# EAGLE design untitled (EAGLE 8.3.2)
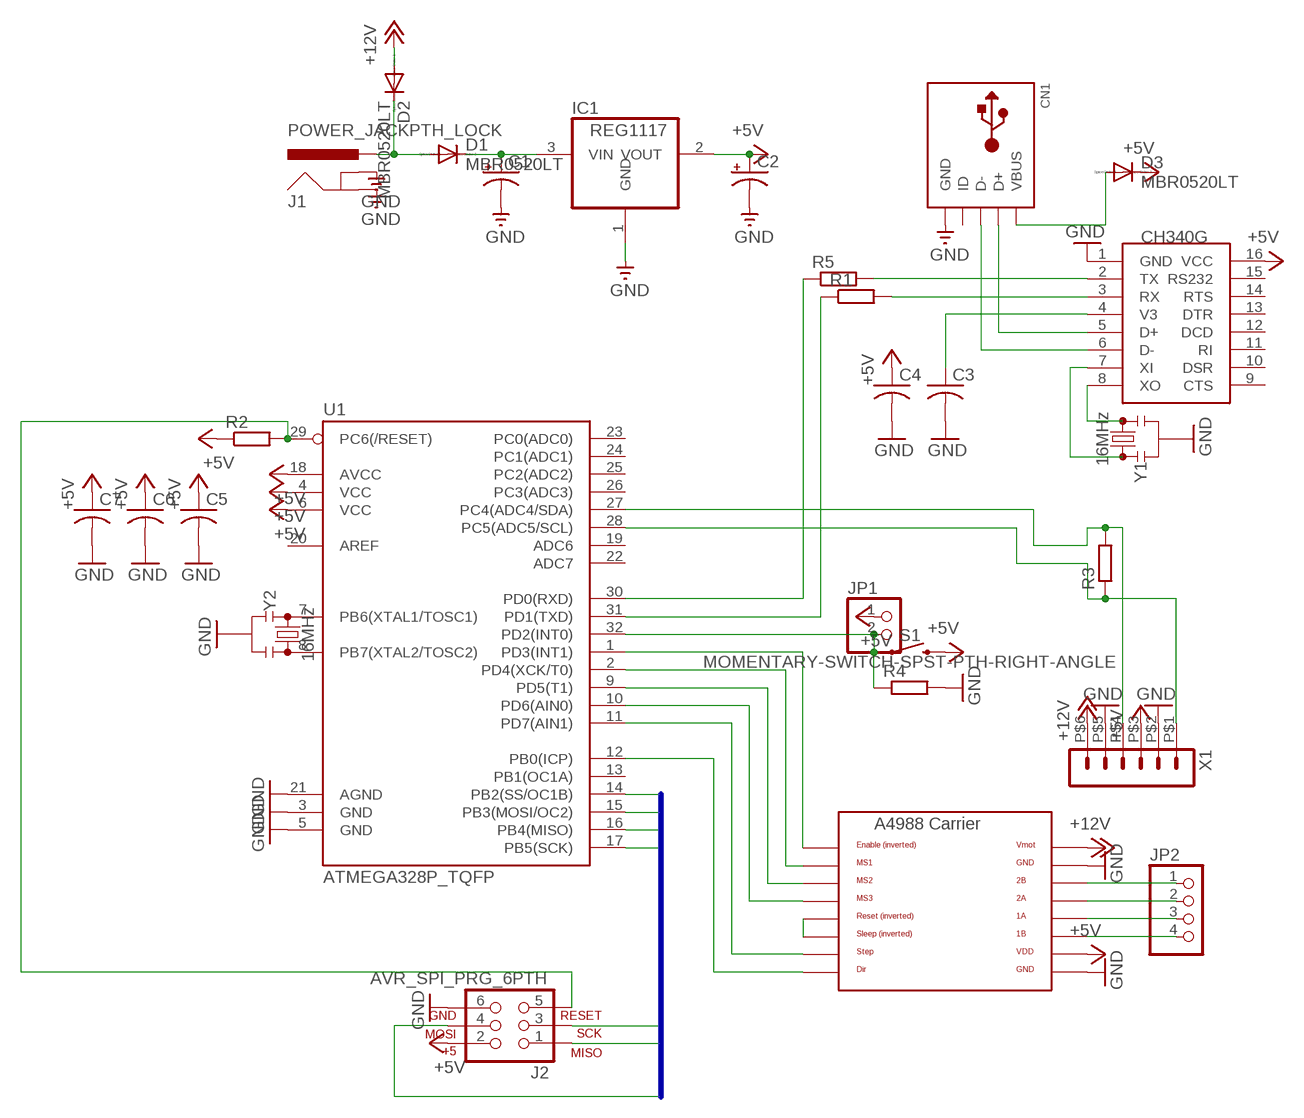
[diagram p0: schematic, sheet 1]

## Parts
C1  CPOL-US153CLV-0405  [153CLV-0405]
C2  CPOL-US153CLV-0405  [153CLV-0405]
C3  C-USC1210  [C1210]
C4  C-USC1210  [C1210]
C5  C-USC1210  [C1210]
C6  C-USC1210  [C1210]
C7  C-USC1210  [C1210]
CN1  USBMINIB  [USB-MINIB]
D1  MBR0520LT  [SOD123]
D2  MBR0520LT  [SOD123]
D3  MBR0520LT  [SOD123]
IC1  REG1117  [SOT223]
J1  POWER_JACKPTH_LOCK  [POWER_JACK_PTH_LOCK]
J2  AVR_SPI_PRG_6PTH  [2X3]
JP1  PINHD-1X2  [1X02]
JP2  PINHD-1X4  [1X04]
R1  R-EU_MELF0207W  [MINI_MELF-0207W]
R2  R-EU_MELF0207W  [MINI_MELF-0207W]
R3  R-EU_MELF0207W  [MINI_MELF-0207W]
R4  R-EU_MELF0207W  [MINI_MELF-0207W]
R5  R-EU_MELF0207W  [MINI_MELF-0207W]
S1  MOMENTARY-SWITCH-SPST-PTH-RIGHT-ANGLE  [TACTILE_SWITCH_PTH_RIGHT_ANGLE]
U1  ATMEGA328P_TQFP  [TQFP32-08]
U$1  CH340G  [SOIC16]
U$2  A4988BREAKOUT  [A4988BREAKOUT]
X1  HEADER_POS6_43045-0600  [43045-0600]
Y1  16MHz  RESONATOR-16MHZSMD_3.2X1.3  [RESONATOR-SMD-3.2X1.3]
Y2  16MHz  RESONATOR-16MHZSMD_3.2X1.3  [RESONATOR-SMD-3.2X1.3]

## Nets
+5V: C2.+ C4.1 C5.1 C6.1 C7.1 D3.C IC1.2(VOUT) J2.2 JP1.1 R2.1 S1.2 U1.4(VCC) U1.6(VCC) U1.18(AVCC) U$1.16(VCC) U$2.VDD X1.P$3
+12V: D2.A U$2.VMOT X1.P$6
CAN_CS: U1.14(PB2(SS/OC1B))
GND: C1.- C2.- C3.2 C4.2 C5.2 C6.2 C7.2 CN1.GND IC1.1(GND) J1.GND J1.GNDBREAK J2.6 R4.2 U1.3(GND) U1.5(GND) U1.21(AGND) U$1.1(GND) U$2.GND U$2.GND@0(GND) X1.P$2 X1.P$5 Y1.2 Y2.2
MISO: J2.1 U1.16(PB4(MISO))
MOSI: J2.4 U1.15(PB3(MOSI/OC2))
N$1: D1.A D2.C J1.PWR
N$2: R1.2 U$1.3(RX)
N$3: U1.1(PD3(INT1)) U$2.EN
N$4: U1.2(PD4(XCK/T0)) U$2.MS1
N$5: U1.8(PB7(XTAL2/TOSC2)) Y2.3
N$6: U1.7(PB6(XTAL1/TOSC1)) Y2.1
N$7: J2.5 R2.2 U1.29(PC6(/RESET))
N$8: R3.2 U1.27(PC4(ADC4/SDA)) X1.P$4
N$9: U1.9(PD5(T1)) U$2.MS2
N$10: U1.10(PD6(AIN0)) U$2.MS3
N$11: R3.1 U1.28(PC5(ADC5/SCL)) X1.P$1
N$12: C1.+ D1.C IC1.3(VIN)
N$99: JP1.2 R4.1 S1.1 U1.32(PD2(INT0))
N$100: U1.11(PD7(AIN1)) U$2.STEP
N$101: U1.12(PB0(ICP)) U$2.DIR
N$102: U$2.RST U$2.SLP(SLEEP)
N$103: JP2.1 U$2.2B
N$104: JP2.2 U$2.2A
N$105: JP2.3 U$2.1A
N$106: JP2.4 U$2.1B
N$107: U$1.8(XO) Y1.3
N$108: U$1.7(XI) Y1.1
N$109: R5.1 U1.30(PD0(RXD))
N$110: R1.1 U1.31(PD1(TXD))
N$111: R5.2 U$1.2(TX)
N$148: CN1.D+ U$1.5(D+)
N$149: CN1.D- U$1.6(D-)
N$150: CN1.VBUS D3.A
N$151: C3.1 U$1.4(V3)
SCK: J2.3 U1.17(PB5(SCK))
Unconnected: CN1.ID U1.13(PB1(OC1A)) U1.19(ADC6) U1.20(AREF) U1.22(ADC7) U1.23(PC0(ADC0)) U1.24(PC1(ADC1)) U1.25(PC2(ADC2)) U1.26(PC3(ADC3)) U$1.9(CTS) U$1.10(DSR) U$1.11(RI) U$1.12(DCD) U$1.13(DTR) U$1.14(RTS) U$1.15(RS232)

## Buses
SCK,MISO,MOSI,CAN_INT,CAN_CS

## Library data of the parts
C1 C2 = rcl:CPOL-US: POLARIZED CAPACITOR, American symbol
C3-C7 = rcl:C-US: CAPACITOR, American symbol
CN1 = adafruit:USB: USB Connectors USBMINIB - Surface Mount Female Mini-B USB Connector 4UConnector: 06564 By microbuilder.eu Thru-hole RA Female Mini-B USB Connector 4UConnector: 18732 By ladyada.net
D1-D3 = diode:MBR0520LT: SCHOTTKY BARRIER RECTIFIER Source: http://onsemi.com .. MBR0520LT1-D.pdf
IC1 = burr-brown:REG1117: 800mA and 1A Low Dropout (LDO) Positive Regulator 1.8V, 2.5V, 2.85V, 3.3V, 5V, and Adj
J1 = SparkFun:POWER_JACK: Power Jack This is the standard 5.5mm barrel jack for power. The PTH is the most common, proven, reliable, footprint. All others are experimental. The Slot footprint only works if the mill layer is transmitted to the PCB fab house so be warned. Spark Fun Electronics SKU : PRT-00119. Mating wall wart : TOL-00298 (and others)
J2 = SparkFun-Connectors:AVR_SPI_PRG_6: AVR ISP 6 Pin This is the reduced ISP connector for AVR programming. Common on Arduino. This footprint will take up less PCB space and can be used with a 10-pin to 6-pin adapter such as SKU: BOB-08508 **Special note about "TEST_POINT" package. The stop mask is on the top side, so if you want your programming test points to be on the bottom of your board, make sure to place this package on the bottom side of the board. This also ensure that the orientation to program from the bottom side will be correct.
JP1 = pinhead:PINHD-1X2: PIN HEADER
JP2 = pinhead:PINHD-1X4: PIN HEADER
R1-R5 = rcl:R-EU_: RESISTOR, European symbol
S1 = SparkFun-Switches:MOMENTARY-SWITCH-SPST: Momentary Switch (Pushbutton) - SPST Normally-open (NO) SPST momentary switches (buttons, pushbuttons). Variants PTH-12MM - 12mm square, through-hole Momentary Pushbutton Switch - 12mm Square <https://www.sparkfun.com/products/9190> (COM-09190) PTH-6.0MM, PTH-6.0MM-KIT - 6.0mm square, through-hole Mini Pushbutton Switch <https://www.sparkfun.com/products/97> (COM-00097) KIT package intended for soldering kit's - only one side of pads' copper is exposed. PTH-RIGHT-ANGLE-KIT - Right-angle, through-hole Right Angle Tactile Button <https://www.sparkfun.com/products/10791> - Used on SparkFun BigTime Watch Kit <https://www.sparkfun.com/products/11734> SMD-12MM - 12mm square, surface-mount Tactile Button - SMD (12mm) <https://www.sparkfun.com/products/12993> (COM-12993) Used on SparkFun PicoBoard <https://www.sparkfun.com/products/11888> SMD-4.5MM - 4.5mm Square Trackball Switch Used on SparkFun Blackberry Trackballer Breakout <https://www.sparkfun.com/products/13169> SMD-4.6MMX2.8MM - 4.60mm x 2.80mm, surface mount Used on SparkFun SAMD21 Mini Breakout <https://www.sparkfun.com/products/13664> SMD-5.2MM, SMD-5.2-REDUNDANT - 5.2mm square, surface-mount Mini Pushbutton Switch - SMD <https://www.sparkfun.com/products/8720> (COM-08720) Used on Arduino Pro Mini <https://www.sparkfun.com/products/11114> REDUNDANT package connects both switch circuits together SMD-6.0X3.5MM - 6.0 x 3.5mm, surface mount Momentary Reset Switch SMD <https://www.sparkfun.com/products/8229> (COM-08229) SMD-6.2MM-TALL - 6.2mm square, surface mount Tactile Button - SMD (6mm) <https://www.sparkfun.com/products/12992> Used on SparkFun Digital Sandbox <https://www.sparkfun.com/products/12651> SMD-RIGHT-ANGLE - Right-angle, surface mount Used on SparkFun Block for Intel® Edison - Arduino <https://www.sparkfun.com/products/13036>; PROD_ID: CONN-10672; SF_SKU: COM-10791
U1 = SparkFun-DigitalIC:ATMEGA328P_TQFP; PROD_ID: IC-09069
U$1 = ch340g:CH340G
U$2 = RepRapjr:A4988BREAKOUT
X1 = con-molex-micro-fit-3_0:HEADER_POS6_?: Molex - Micro-Fit 3.0 Series connector, 3.00mm (0.118") pitch header, 6 positions.
Y1 Y2 = SparkFun-Clocks:RESONATOR-16MHZ: 16MHz Resonator Digikey Example <http://www.digikey.com/product-detail/en/murata-electronics-north-america/CSTCE16M0V53-R0/490-1198-1-ND/584635> Frequency: 16MHz Frequency Stability: ±0.3% Frequency Tolerance: ±0.5% Capacitance: 15pF SparkFun Products SparkFun OpenLog <https://www.sparkfun.com/products/13712> SparkFun MicroView - OLED Arduino Module <https://www.sparkfun.com/products/12923>; PROD_ID: XTAL-08900

## Board
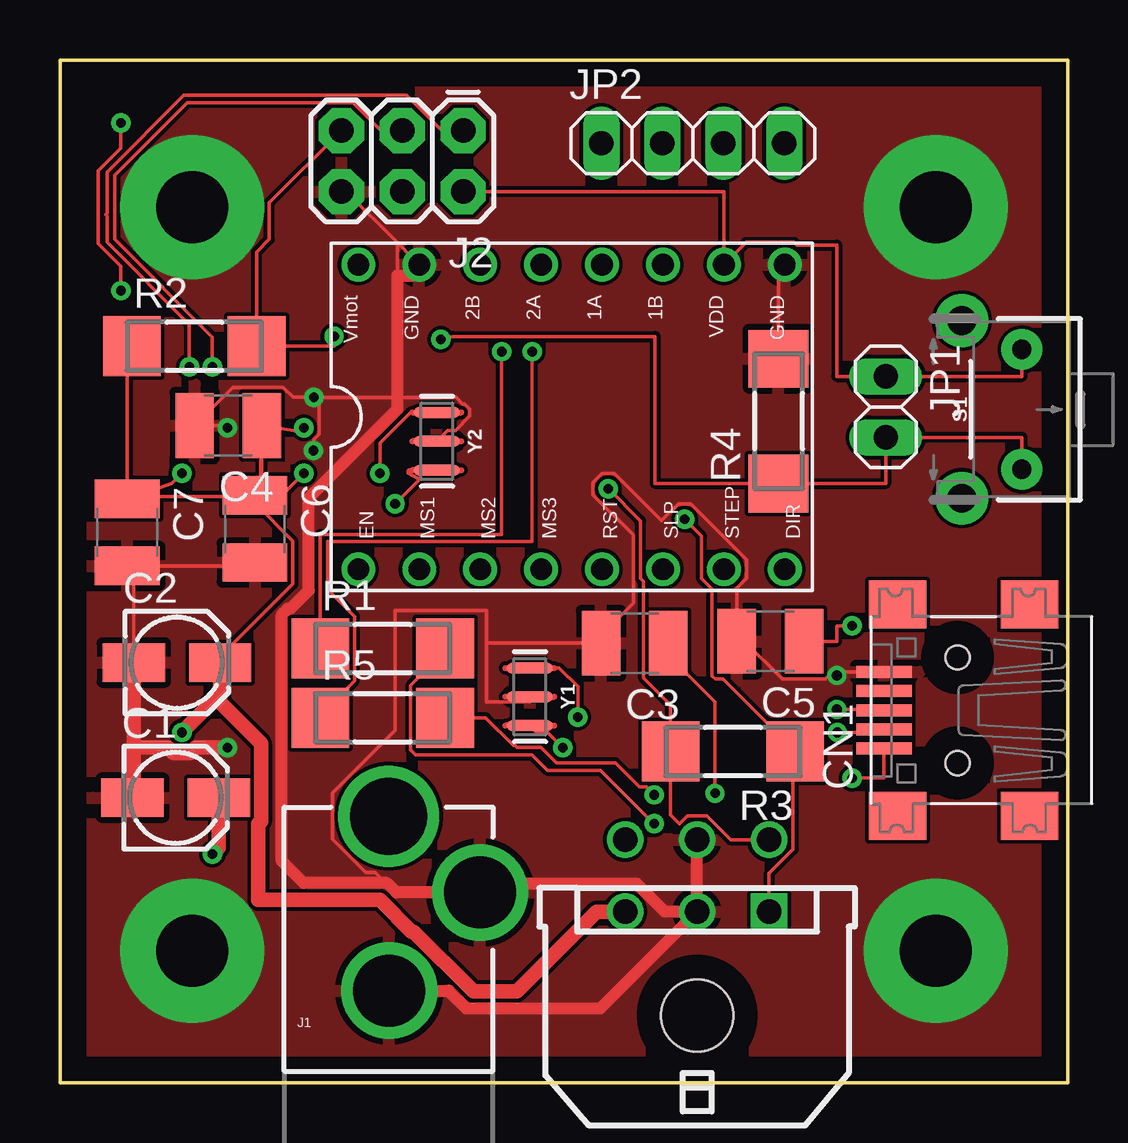
[diagram p1: board, top side]
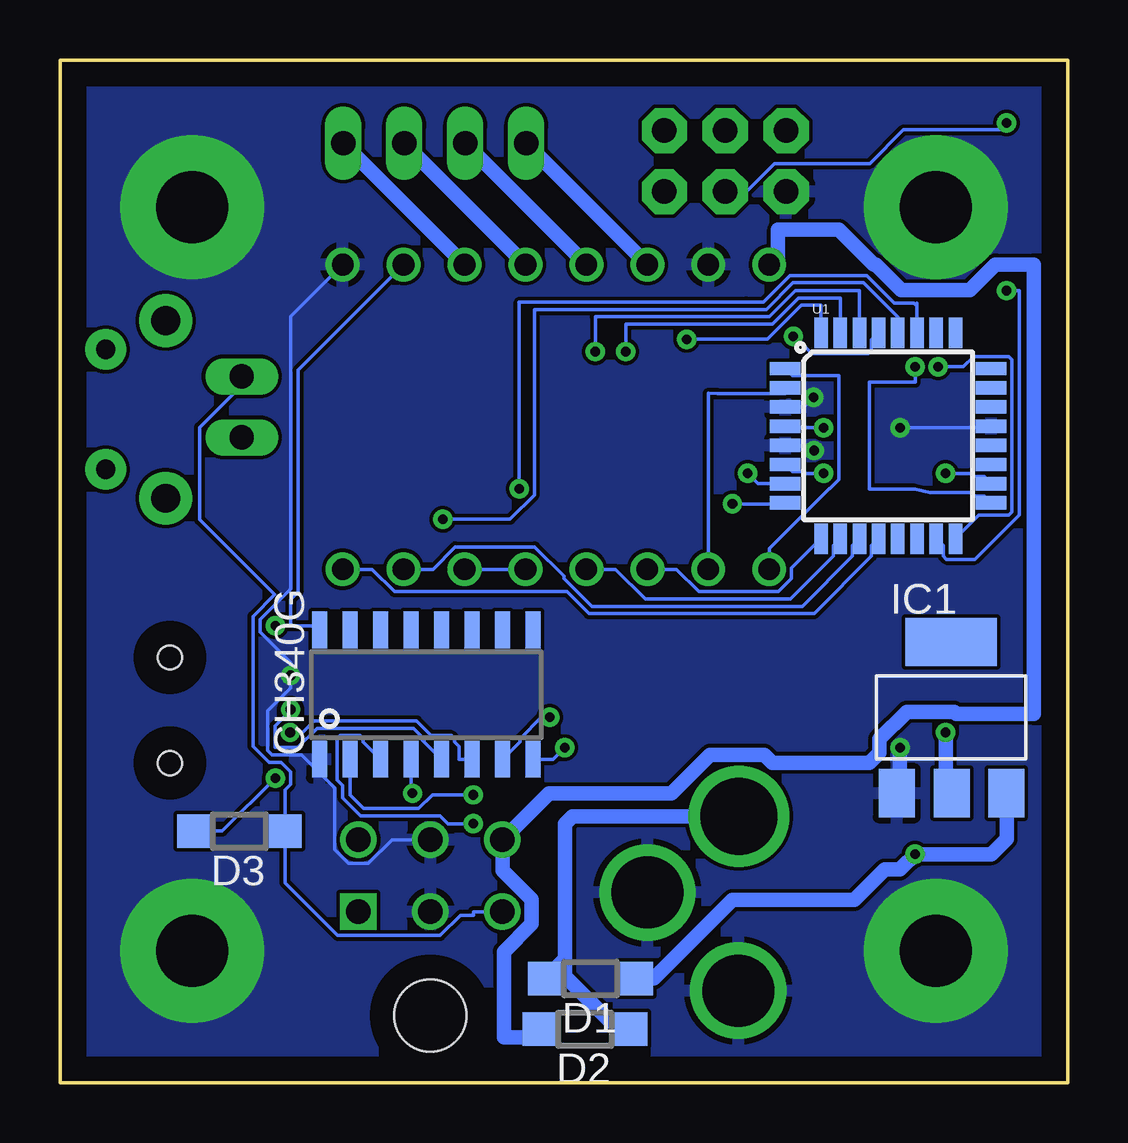
[diagram p2: board, bottom side, seen from below]

Size 42 x 42.63 mm. Coordinates in mm from the lower left corner, seen from the top.
Outline: 0,0 0,42.63 42,42.63 42,0 0,0
Copper layers (1*16): Top 0.035mm / dielectric 1.5mm / Bottom 0.035mm
Design rules "default": minimum track width 6mil, minimum drill 0.35mm, track to track 6mil, track to pad 6mil, pad to pad 6mil, via to via 6mil, smd to smd 6mil, copper to edge 40mil, drill to drill 6mil, minimum pad ring 10mil, minimum via ring 8mil, stop-mask expansion 4mil, vias tented up to drill 0mil, thermal gap 10mil

### Footprints (pad centres in the part's own frame; a part is rotated, then mirrored left to right if it is on the bottom)
153CLV-0405 = smd 2.6 x 1.6: + 1.8,0; - -1.8,0
C1210 = smd 1.6 x 2.7: 1 -1.4,0; 2 1.4,0
USB-MINIB = smd 0.5 x 2.308: D+ 0,4.064; D- -0.8,4.064; GND 1.6,4.064; ID 0.8,4.064; VBUS -1.6,4.064 | smd 2 x 2.4: GND1 -4.4,-2; GND2 -4.4,3.5; GND3 4.4,3.5; GND4 4.4,-2 | hole 1: -2.2,1; 2.2,1
SOD123 = smd 1.4 x 1.4: A 1.9,0; C -1.9,0
SOT223 = smd 1.499 x 2.007: 1 -2.261,-3.15; 2 0.025,-3.15; 3 2.311,-3.15 | smd 3.81 x 2.007: 4 0,3.15
POWER_JACK_PTH_LOCK = drill 2.997: GND 0.025,6.608; GNDBREAK 3.812,10.7 | drill 3.2: PWR 0,13.878
2X3 = drill 1.016 pad 1.88 octagon: 1 0,0; 2 0,2.54; 3 2.54,0; 4 2.54,2.54; 5 5.08,0; 6 5.08,2.54
1X02 = drill 1.016 long: 1 -1.27,0; 2 1.27,0
1X04 = drill 1.016 long: 1 -3.81,0; 2 -1.27,0; 3 1.27,0; 4 3.81,0
MINI_MELF-0207W = smd 2.4 x 2.5: 1 -2.6,0; 2 2.6,0
TACTILE_SWITCH_PTH_RIGHT_ANGLE = drill 0.8 pad 1.7: 1 -2.5,0; 2 2.5,0 | drill 1.2 pad 2.2: ANCHOR1 -3.703,2.5; ANCHOR2 3.703,2.5
TQFP32-08 = smd 1.27 x 0.559: 1 -4.293,2.8; 2 -4.293,2; 3 -4.293,1.2; 4 -4.293,0.4; 5 -4.293,-0.4; 6 -4.293,-1.2; 7 -4.293,-2; 8 -4.293,-2.8; 17 4.293,-2.8; 18 4.293,-2; 19 4.293,-1.2; 20 4.293,-0.4; 21 4.293,0.4; 22 4.293,1.2; 23 4.293,2; 24 4.293,2.8 | smd 0.559 x 1.27: 9 -2.8,-4.293; 10 -2,-4.293; 11 -1.2,-4.293; 12 -0.4,-4.293; 13 0.4,-4.293; 14 1.2,-4.293; 15 2,-4.293; 16 2.8,-4.293; 25 2.8,4.293; 26 2,4.293; 27 1.2,4.293; 28 0.4,4.293; 29 -0.4,4.293; 30 -1.2,4.293; 31 -2,4.293; 32 -2.8,4.293
SOIC16 = smd 0.635 x 1.524: 1 -4.445,-2.695; 2 -3.175,-2.695; 3 -1.905,-2.695; 4 -0.635,-2.695; 5 0.635,-2.695; 6 1.905,-2.695; 7 3.175,-2.695; 8 4.445,-2.695; 9 4.445,2.695; 10 3.175,2.695; 11 1.905,2.695; 12 0.635,2.695; 13 -0.635,2.695; 14 -1.905,2.695; 15 -3.175,2.695; 16 -4.445,2.695
A4988BREAKOUT = drill 0.9: 1A 8.89,1.27; 1B 11.43,1.27; 2A 6.35,1.27; 2B 3.81,1.27; DIR 16.51,-11.43; EN -1.27,-11.43; GND 16.51,1.27; GND@0 1.27,1.27; MS1 1.27,-11.43; MS2 3.81,-11.43; MS3 6.35,-11.43; RST 8.89,-11.43; SLP 11.43,-11.43; STEP 13.97,-11.43; VDD 13.97,1.27; VMOT -1.27,1.27
43045-0600 = drill 1.02 square: P$1 3,4.32 | drill 1.02: P$2 0,4.32; P$3 -3,4.32; P$4 3,7.32; P$5 0,7.32; P$6 -3,7.32 | hole 3: 0,0
RESONATOR-SMD-3.2X1.3 = smd 0.45 x 1.905: 1 -1.2,0; 2 0,0; 3 1.2,0

### Placement (x,y rotation side)
C1  4.82,11.88 0 top
C2  4.88,17.52 0 top
C3  23.95,18.32 180 top
C4  7.01,27.4 180 top
C5  29.61,18.41 180 top
C6  8.12,23.09 270 top
C7  2.8,22.95 270 top
CN1  38.41,15.53 90 top
D1  19.89,4.34 180 bottom
D2  20.12,2.23 180 bottom
D3  34.52,10.49 180 bottom
IC1  4.86,15.22 0 bottom
J1  13.7,-2.77 0 top
J2  16.81,39.69 180 top
JP1  34.42,28.18 270 top
JP2  26.38,39.16 0 top
R1  13.45,18.1 0 top
R2  5.6,30.7 0 top
R3  28.05,13.8 180 top
R4  29.95,27.58 90 top
R5  13.45,15.21 0 top
S1  40.09,28.07 90 top
U1  7.47,26.97 0 bottom
U$1  26.73,16.18 0 bottom
U$2  13.71,32.84 0 top
X1  26.56,2.81 0 top
Y1  19.59,16.09 270 top
Y2  15.71,26.74 270 top

### Tracks (layer width: path | path; a pad name or v marks a point on that pad's centre or on a via)
+5V  (via drill 0.4)
  Top 0.152: C5.1 32.38,18.41 32.38,19.05 v33.02,19.05 | C4.1 10,27.14 v10.16,27.3 | 8.26,24.48 C6.1 | 8.26,24.48 9.24,24.48 v10.16,25.4 | C4.1 8.35,24.58 8.26,24.48 | 3.09,24.43 C7.1 | 3.09,24.43 3.3,24.48 | C7.1 3.26,24.51 4.67,24.98 v5.08,25.4 | R2.1 2.8,30.51 C7.1 | S1.2 40.09,29.45 JP1.1 32.38,29.45 32.38,34.92 30.71,34.92 30.6,35.04 28.61,35.04 U$2.VDD 27.68,37.15 J2.2 | C7.1 2.8,24.43 3.09,24.43 | C6.1 8.12,24.43 | 8.12,24.43 3.09,24.43 | C4.1 8.41,24.43 8.12,24.43 | 6.67,17.14 6.67,17.76 9.7,20.79 9.7,22.58 8.12,24.16 C6.1
  Top 0.61: X1.P$3 22.37,7.13 19.05,3.81 17.24,3.81 14.75,6.3 14.65,6.3 13.34,7.62 8.27,7.62 8.27,10.79 8.38,10.9 8.38,14.14 6.67,15.85 6.67,16.2 | 6.67,16.2 6.67,17.14 C2.+ | 6.67,16.2 v5.08,14.61
  Bottom 0.152: X1.P$3 24.77,7.13 24.77,6.99 25.3,6.99 26.15,6.14 30.42,6.14 32.62,8.34 D3.C 32.62,12.2 32.39,12.44 32.39,12.96 32.79,13.36 33.29,13.36 33.96,14.03 33.96,19.44 33.05,20.35 36.18,23.48 36.18,27.32 34.42,29.07 JP1.1 | 32.38,19.05 31.35,19.05 U$1.16 | 32.38,19.05 v33.02,19.05 | 10.6,27.3 v10.16,27.3 11.7,27.3 U1.4 | v10.16,25.4 10.96,25.4 11.04,25.48 11.48,25.48 U1.6 | U1.18 3.47,25.26 3.91,25.26 4.05,25.4 v5.08,25.4 | 32.38,19.05 32.38,20.15 32.08,20.45 32.08,29.7 U$2.VDD | IC1.2 4.83,12.32 5.08,12.32
  Bottom 0.61: 5.08,12.32 v5.08,14.61
+12V
  Bottom 0.61: D2.A 22.32,1.91 23.5,1.91 23.5,5.47 22.34,6.62 22.34,7.64 23.56,8.86 X1.P$6 21.62,12.06 16.51,12.06 14.9,13.67 12.64,13.67 12.3,13.34 8.26,13.34 7.84,13.74 7.84,14.33 6.71,15.46 4.72,15.46 4.62,15.37 1.4,15.37 1.4,34.1 3.01,34.1 4.07,33.04 6.93,33.04 7.99,34.1 8.07,34.1 9.53,35.56 12.06,35.56 12.06,34.29 U$2.VMOT
GND  (via drill 0.4, 3 pad 6)
  Top 0.152: v10.56,26.35 10.56,26.82 10.79,27.04 10.79,28.57 | 10.79,28.57 v10.58,28.57 9.71,28.57 9.31,28.98 7.19,28.98 C4.2 6.99,27.4 v6.99,27.3 | C6.2 7.99,21.55 C7.2 3.08,21.27 C2.- | 14.06,28.57 15.87,28.57 16.51,28.57 16.79,28.3 16.87,28.3 17.08,28.09 17.08,27.79 16.48,27.2 16.16,27.2 15.76,26.79 15.76,26.74 Y2.2 | 14.06,28.57 10.79,28.57 | R4.2 29.95,34.1 U$2.GND | U$2.GND@0 14.7,34.38 14.06,35.02 | 14.06,35.02 11.93,37.15 J2.6 | Y1.2 19.59,15.88 17.78,15.88 17.78,18.32 | 22.23,18.32 C3.2 | 22.23,18.32 17.78,18.32 | 17.78,18.32 17.78,19.68 13.97,19.68 13.97,14.68 11.36,12.08 11.36,10.14 12.73,8.77 13.13,8.77 13.97,7.93 J1.GNDBREAK | CN1.GND 32.38,17.13 v32.38,16.98 32.06,16.98 31.91,16.83 30.12,16.83 28.54,18.41 C5.2 28.21,20.62 28.61,21.02 28.61,21.82 26.3,24.13 25.77,24.13 25.08,23.44 23.12,25.4 22.6,25.4 22.23,25.03 22.23,24.5 23.9,22.83 23.9,20 22.23,18.32 | 14.06,35.02 14.06,33.66 14.06,28.57
  Top 0.508: 14.7,34.38 14.7,33.66 14.06,33.66 14.06,28.08 10.37,24.39 10.37,20.53 9.6,19.76 9.48,19.76 9.24,19.52 9.24,9.25 10.16,8.33 13.63,8.33 14.03,7.93 J1.GNDBREAK 17.69,7.93 18.06,8.3 24.05,8.3 25.22,7.13 X1.P$2 | J1.GND 16.2,3.84 16.94,3.1 22.53,3.1 X1.P$2 | X1.P$2 X1.P$5
  Top 0.61: C2.- 3.08,13.97 | 3.08,13.97 3.08,11.94 C1.- | 3.08,13.97 4.5,13.97 4.72,13.74 5.44,13.74 5.66,13.97 v6.99,13.97
  Bottom 0.152: U1.3 10.98,28.17 v10.58,28.57 | U1.5 10.78,26.57 v10.56,26.35 | X1.P$5 28.16,10.13 29.15,9.14 29.97,9.14 30.55,9.72 30.55,12.3 31.92,13.66 33.16,13.66 33.34,13.84 33.34,15.5 32.38,16.46 v32.38,16.98 32.38,17.52 33.65,18.79 33.65,19.31 32.38,20.58 32.38,31.93 U$2.GND | v6.99,27.3 3.18,27.3 U1.21
  Bottom 0.61: v6.99,13.97 6.99,12.2 IC1.1
  other vias: 5.5,5.5 36.5,5.5 36.5,36.5 5.5,36.5
  pour Top: 0,42.55 0,0 41.91,0 41.91,42.55
  pour Bottom: 0,42.55 0,0 41.91,0 41.91,42.55
MISO  (via drill 0.4)
  Top 0.152: J2.1 15.92,39.69 14.45,41.16 5.17,41.16 1.97,37.96 1.97,36.26 1.91,36.2 1.97,36.13 1.97,35.04 5.39,31.61 v5.39,29.84
  Bottom 0.152: 5.71,29.84 v5.39,29.84 4.34,29.84 3.91,30.28 2.45,30.28 2.32,30.14 2.32,23.8 2.45,23.66 3.69,23.66 U1.16
MOSI  (via drill 0.4)
  Top 0.152: v2.54,33.02 2.54,34.03 1.6,34.97 1.6,38.03 2.54,38.97 v2.54,40.01
  Bottom 0.152: J2.4 13.38,37.15 12.21,38.32 8.25,38.32 6.84,39.73 2.82,39.73 v2.54,40.01 | U1.15 5.18,22.39 5.18,21.95 5.05,21.81 3.87,21.81 2.01,23.67 2.01,33.02 v2.54,33.02
N$1
  Bottom 0.61: J1.PWR 20.64,11.11 20.95,10.79 20.95,5.17 | 20.95,5.17 D1.A | 20.95,5.17 20.95,4.45 19.05,2.54 18.52,2.54 D2.C
N$2  (via drill 0.4)
  Top 0.152: R1.2 16.05,17.98 14.62,16.55 14.62,13.87 14.82,13.66 19.68,13.66 20.32,13.03 22.53,13.03 v24.77,10.79
  Bottom 0.152: v24.77,10.79 25.82,10.79 26.15,11.13 29.46,11.13 30.21,11.87 30.21,12.39 30.45,12.63 30.45,14.34 30.32,14.48 29.49,14.48 29.36,14.34 29.36,14.21 U$1.3
N$3
  Bottom 0.152: U$2.EN 12.44,22.27 9.93,24.77 9.9,24.77 9.53,25.14 9.53,29.47 9.53,29.48 11.48,29.48 U1.1
N$4
  Bottom 0.152: U$2.MS1 14.97,28.74 14.6,28.73 11.77,28.73 U1.2
N$5  (via drill 0.4)
  Top 0.152: Y2.3 14.54,25.54 14.5,25.5 14.5,25.41 14.92,25.2 14.92,25.08 v13.97,24.13
  Bottom 0.152: v13.97,24.13 11.81,24.13 U1.8
N$6  (via drill 0.4)
  Top 0.152: v13.34,25.4 13.34,26.67 14.61,27.94 Y2.1
  Bottom 0.152: U1.7 12.9,24.97 v13.34,25.4
N$7  (via drill 0.4)
  Top 0.152: v11.43,31.11 11.43,30.7 R2.2 8.2,34.63 8.73,35.16 8.73,36.69 J2.5
  Bottom 0.152: v11.43,31.11 11.37,31.11 10.65,30.4 8.3,30.4 8.17,30.53 8.17,30.97 U1.29
N$8  (via drill 0.4)
  Top 0.152: X1.P$4 27.96,10.13 26.97,11.12 26.15,11.12 25.82,10.79 25.45,11.16 R3.2 25.45,15.76 24.33,16.88 24.33,20.89 24.2,21.02 24.2,23.42 v22.86,24.77
  Bottom 0.152: 6.28,32.38 U1.27 | 6.28,32.38 6.4,32.51 7.23,32.51 8.37,33.66 11.57,33.66 12.68,32.54 13.34,32.54 | 13.34,32.54 13.46,32.54 | v22.86,24.77 22.86,32.54 13.34,32.54 | 6.28,32.51 6.28,32.38
N$9
  Bottom 0.152: U1.9 11.5,21.45 11.5,21.02 12.05,20.47 15.36,20.47 16.29,21.41 U$2.MS2
N$10
  Bottom 0.152: U1.10 9.77,22.39 9.77,21.95 11.55,20.17 17.6,20.17 18.83,21.41 U$2.MS3
N$11  (via drill 0.4)
  Top 0.152: X1.P$1 29.56,8.72 30.55,9.72 30.55,13.71 R3.1 27.63,16.83 27.32,16.83 27.18,16.96 27.18,20.58 26.74,21.02 26.74,22.79 v26.04,23.5
  Bottom 0.152: U1.28 7.08,31.93 8.5,33.35 11.44,33.35 12.56,32.23 22.23,32.23 22.23,31.11 22.23,24.5 23.23,23.5 v26.03,23.5 v26.04,23.5
N$12  (via drill 0.4)
  Top 0.61: C1.+ 6.62,9.79 v6.35,9.53
  Bottom 0.61: D1.C 17.25,4.34 13.97,7.62 8.89,7.62 7.62,8.89 7,8.89 6.93,8.96 6.92,8.96 v6.35,9.53 3.17,9.53 2.54,10.16 IC1.3
N$99  (via drill 0.4)
  Top 0.152: S1.1 40.09,26.91 JP1.2 34.42,24.98 R4.1 24.81,24.98 24.81,31.11 16.39,31.11 v15.88,30.99
  Bottom 0.152: U1.32 10.28,32.41 11.09,32.41 12.51,30.99 v15.88,30.99
N$100
  Bottom 0.152: U$2.STEP 26.45,21.41 25.52,22.34 22.21,22.34 20.99,21.12 20.99,21.02 19.83,19.86 11.05,19.86 8.97,21.95 8.97,22.39 U1.11
N$101
  Bottom 0.152: U$2.DIR 28.99,21.41 28.06,20.47 20.87,20.47 19.96,19.56 10.56,19.56 8.17,21.95 8.17,22.39 U1.12
N$102
  Bottom 0.152: U$2.RST U$2.SLP
N$103
  Bottom 0.61: JP2.1 U$2.2B
N$104
  Bottom 0.61: JP2.2 U$2.2A
N$105
  Bottom 0.61: JP2.3 U$2.1A
N$106
  Bottom 0.61: JP2.4 U$2.1B
N$107  (via drill 0.4)
  Top 0.152: v20.95,13.97 20.32,14.61 19.87,14.61 Y1.3
  Bottom 0.152: U$1.8 21.44,13.48 v20.95,13.97
N$108  (via drill 0.4)
  Top 0.152: Y1.1 20.81,17.29 21.59,16.51 v21.59,15.24
  Bottom 0.152: U$1.7 22.83,14.21 22.83,14.34 21.93,15.24 v21.59,15.24
N$109  (via drill 0.4)
  Top 0.152: R5.1 10.85,15.33 12.28,16.75 12.28,19.45 11.15,20.57 11.15,22.55 19.68,22.55 v19.68,30.48 19.68,29.84
  Bottom 0.152: U1.30 8.68,33.02 11.34,33.02 12.43,31.93 19.68,31.93 v19.68,30.48
N$110  (via drill 0.4)
  Top 0.152: R1.1 10.85,22.86 18.41,22.86 v18.41,30.48
  Bottom 0.152: U1.31 9.47,32.72 11.21,32.72 12.3,31.62 18.41,31.62 v18.41,30.48
N$111  (via drill 0.4)
  Top 0.152: v24.77,12 24.44,12.33 24.16,12.33 23.15,13.34 22.23,13.34 22.22,13.34 20.69,13.34 20.06,13.97 19.05,13.97 18.96,14.06 18.9,14.06 17.75,15.21 R5.2
  Bottom 0.152: U$1.2 29.91,12 29.34,11.43 27.04,11.43 26.48,12 v24.77,12
N$148  (via drill 0.4)
  Top 0.152: CN1.D+ 34.35,15.56 v32.38,15.56
  Bottom 0.152: v32.38,15.56 32.38,15.52 33.04,14.87 33.04,13.97 32.38,13.97 | 32.38,13.97 32.09,13.97 | 32.38,13.97 32.09,13.97 | 32.09,13.97 31.28,14.78 27.26,14.78 26.88,14.4 | 26.88,14.4 26.83,14.35 | 26.82,14.34 26.82,14.21 U$1.5 26.88,14.27 26.88,14.4
N$149  (via drill 0.4)
  Top 0.152: CN1.D- 34.35,14.61 v32.41,14.61
  Bottom 0.152: 32.38,14.61 v32.41,14.61 31.89,14.61 31.41,15.09 27.13,15.09 26.52,14.48 25.68,14.48 25.55,14.34 25.55,14.21 25.36,14.02 25.36,13.48 U$1.6
N$150  (via drill 0.4)
  Top 0.152: CN1.VBUS 34.35,12.7 v33.02,12.7
  Bottom 0.152: v33.02,12.7 35.23,10.49 D3.A
N$151  (via drill 0.4)
  Top 0.152: v27.3,12.06 27.3,15.88 25.4,17.78 25.4,18.32 C3.1
  Bottom 0.152: U$1.4 27.36,12.06 v27.3,12.06
SCK  (via drill 0.4)
  Top 0.152: J2.3 13.38,39.69 12.21,40.86 5.29,40.86 2.27,37.84 2.27,35.16 6.35,31.08 v6.35,29.84
  Bottom 0.152: v6.35,29.84 6.35,29.21 8.25,29.21 8.25,24.74 6.36,24.74 5.75,24.61 4.06,24.61 3.91,24.46 3.47,24.46 U1.17